# EAGLE schematic schema (EAGLE 9.4.2)
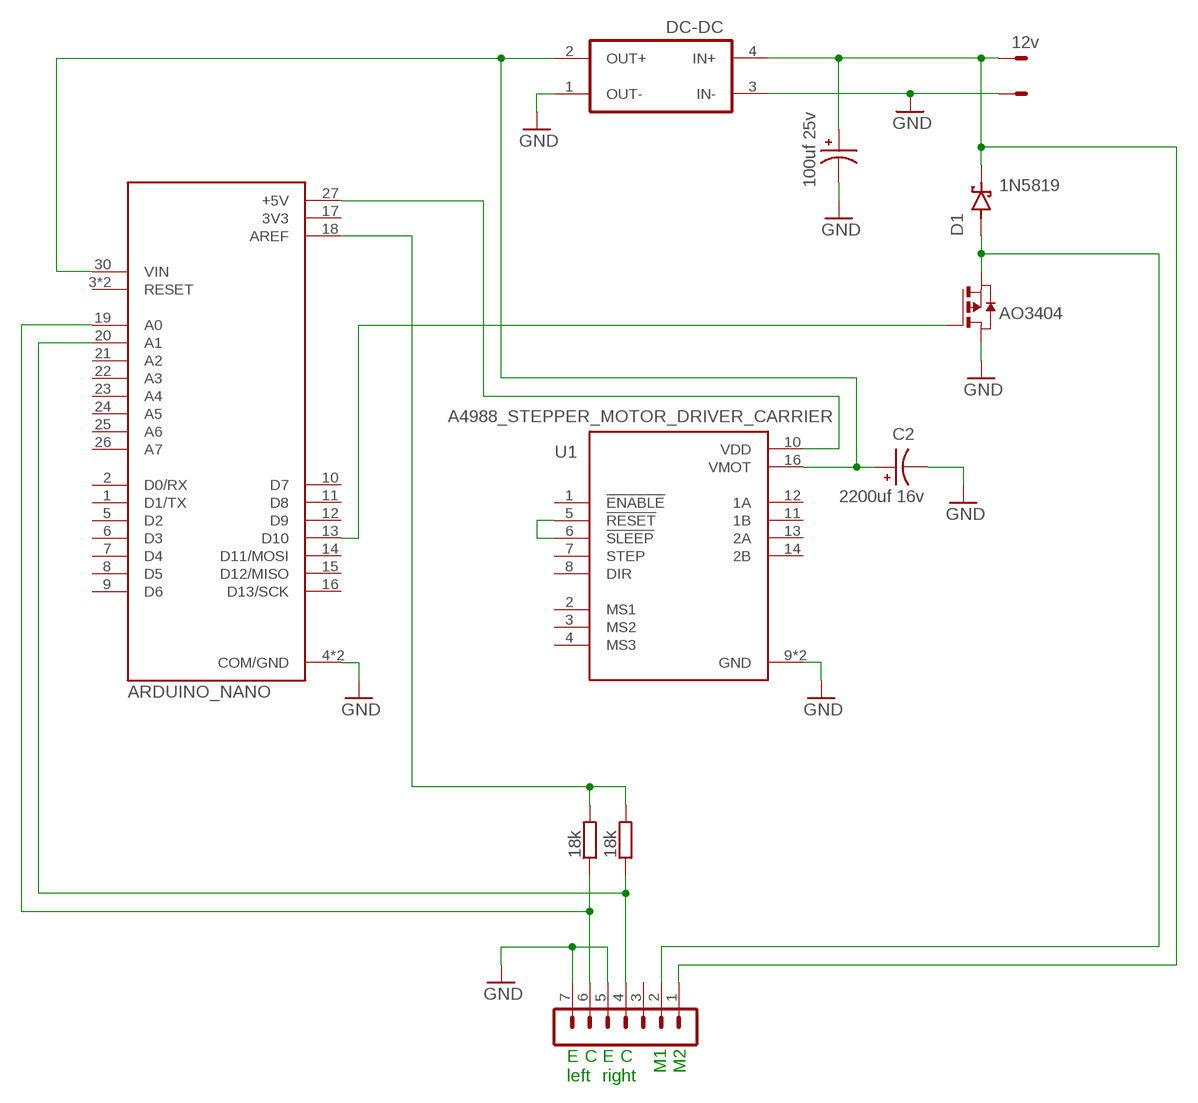
[diagram p0: schematic, sheet 1]

## Parts
C1  100uf 25v  EEUEB1E101H  [CAPPRD250W50D630H1500]
C2  2200uf 16v  EEUFM1C222  [CAPPRD500W60D1250H2500]
D1  1N5819  1N5819HW-7  [SOD3715X145N]
R1  18k  R  (no package)
R3  18k  R  (no package)
SV1  MA07-1  [MA07-1]
TB1  ARDUINO_NANO  [SHIELD_ARDUINO_NANO]
U1  A4988_STEPPER_MOTOR_DRIVER_CARRIER  [MODULE_A4988_STEPPER_MOTOR_DRIVER_CARRIER]
U$1  DC-DC_CONV  [DC-DC_CONV]
U$2  AO3404  AO3401  [SOT23]
X2  12v  22-23-2021  [22-23-2021]

## Nets
D10: TB1.13(D10) U$2.1(G)
GND: C1.N C2.N SV1.5 SV1.7 TB1.4(COM/GND) TB1.29(COM/GND) U1.9(GND) U1.15(GND) U$1.1(OUT-) U$1.3(IN-) U$2.3(D) X2.2
N$1: C1.P U$1.4(IN+) X2.1
N$2: D1.C(K) SV1.1
N$3: D1.A SV1.2 U$2.2(S)
N$4: R1.1 SV1.4 TB1.20(A1)
N$5: R3.1 SV1.6 TB1.19(A0)
N$6: R1.2 R3.2 TB1.18(AREF)
N$8: C2.P TB1.30(VIN) U1.16(VMOT) U$1.2(OUT+)
N$9: TB1.27(+5V) U1.10(VDD)
N$10: U1.5(!RESET) U1.6(!SLEEP)
Unconnected: SV1.3 TB1.1(D1/TX) TB1.2(D0/RX) TB1.3(RESET) TB1.5(D2) TB1.6(D3) TB1.7(D4) TB1.8(D5) TB1.9(D6) TB1.10(D7) TB1.11(D8) TB1.12(D9) TB1.14(D11/MOSI) TB1.15(D12/MISO) TB1.16(D13/SCK) TB1.21(A2) TB1.22(A3) TB1.23(A4) TB1.24(A5) TB1.25(A6) TB1.26(A7) TB1.28(RESET) U1.1(!ENABLE) U1.2(MS1) U1.3(MS2) U1.4(MS3) U1.7(STEP) U1.8(DIR) U1.11(1B) U1.12(1A) U1.13(2A) U1.14(2B)

## Notes on the sheet
- E | C | E | C
- M1 | M2
- left | right

## Power pins joined to a net without a drawn wire
3V3: TB1.17(3V3)

## Library data of the parts
C1 = EEUEB1E101H:EEUEB1E101H: EB-A Check availability <https://pricing.snapeda.com/parts/EEU-EB1E101H/Panasonic%20Electronic%20Components/view-part?ref=eda>; AVAILABILITY: In Stock; CHECK_PRICES: https://www.snapeda.com/parts/EEU-EB1E101H/Panasonic/view-part/?ref=eda; DESCRIPTION: CAP ALUM 100UF 20% 25V RADIAL; MF: Panasonic Electronic Components; MP: EEU-EB1E101H; PACKAGE: RADIAL-2 Panasonic; PRICE: None; SNAPEDA_LINK: https://www.snapeda.com/parts/EEU-EB1E101H/Panasonic/view-part/?ref=snap
C2 = EEUFM1C222:EEUFM1C222: FM-A Check availability <https://pricing.snapeda.com/parts/EEU-FM1C222/Panasonic/view-part?ref=eda>; AVAILABILITY: In Stock; CHECK_PRICES: https://www.snapeda.com/parts/EEU-FM1C222/Panasonic/view-part/?ref=eda; DESCRIPTION: Capacitor,Alum Lytic,Cap 2200 uF,Tol 20%,Vol-Rtg 16 VDC,Radial,12.5x25,Bulk | Panasonic Electronic Components EEU-FM1C222; MF: Panasonic; MP: EEU-FM1C222; PACKAGE: RADIAL-2 Panasonic; PRICE: None; PURCHASE-URL: https://www.snapeda.com/api/url_track_click_mouser/?unipart_id=2301865&manufacturer=Panasonic&part_name=EEU-FM1C222&search_term=2200uf 16v; SNAPEDA_LINK: https://www.snapeda.com/parts/EEU-FM1C222/Panasonic/view-part/?ref=snap
D1 = 1N5819HW-7:1N5819HW-7: 1N5819HW Series 40 V 1 A Surface Mount Schottky Barrier Rectifier - SOD-123 Check availability <https://pricing.snapeda.com/parts/1N5819HW-7/Diodes%20Inc./view-part?ref=eda>; AVAILABILITY: In Stock; CHECK_PRICES: https://www.snapeda.com/parts/1N5819HW-7/Diodes+Inc./view-part/?ref=eda; DESCRIPTION: Diode Schottky 40 V 1A Surface Mount SOD-123; MF: Diodes Inc.; MP: 1N5819HW-7; PACKAGE: SOD-123 Fairchild Semiconductor; PRICE: None; PURCHASE-URL: https://www.snapeda.com/api/url_track_click_mouser/?unipart_id=51510&manufacturer=Diodes Inc.&part_name=1N5819HW-7&search_term=1n5819; SNAPEDA_LINK: https://www.snapeda.com/parts/1N5819HW-7/Diodes+Inc./view-part/?ref=snap
R1 R3 = ngspice-simulation:R: RESISTOR
SV1 = con-lstb:MA07-1: PIN HEADER; OC_FARNELL: unknown; OC_NEWARK: unknown
TB1 = ARDUINO_NANO:ARDUINO_NANO: Arduino Nano, Through Hole Check availability <https://pricing.snapeda.com/parts/Arduino%20Nano/Arduino/view-part?ref=eda>; AVAILABILITY: Not in stock; CHECK_PRICES: https://www.snapeda.com/parts/Arduino%20Nano/Arduino/view-part/?ref=eda; DESCRIPTION: Small, complete, and breadboard-friendly board based on the ATmega328 (Arduino Nano 3.x); MF: Arduino; MP: Arduino Nano; PACKAGE: Non-Standard Arduino; PRICE: None; SNAPEDA_LINK: https://www.snapeda.com/parts/Arduino%20Nano/Arduino/view-part/?ref=snap
U1 = A4988_STEPPER_MOTOR_DRIVER_CARRIER:A4988_STEPPER_MOTOR_DRIVER_CARRIER: Stepper motor controler; IC: A4988; 1A; Uin mot: 8÷35V Check availability <https://pricing.snapeda.com/parts/A4988%20STEPPER%20MOTOR%20DRIVER%20CARRIER/Pololu/view-part?ref=eda>; AVAILABILITY: Not in stock; CHECK_PRICES: https://www.snapeda.com/parts/A4988%20STEPPER%20MOTOR%20DRIVER%20CARRIER/Pololu/view-part/?ref=eda; DESCRIPTION: Stepper Motor Driver; MF: Pololu; MP: A4988 STEPPER MOTOR DRIVER CARRIER; PACKAGE: None; PRICE: None; SNAPEDA_LINK: https://www.snapeda.com/parts/A4988%20STEPPER%20MOTOR%20DRIVER%20CARRIER/Pololu/view-part/?ref=snap
U$1 = devkrzyzanowskiLib:DC-DC_CONV
U$2 = AO3401:AO3401: Check availability <https://pricing.snapeda.com/parts/AO3401/Alpha%20%26%20Omega%20Semiconductor/view-part?ref=eda>; AVAILABILITY: In Stock; CHECK_PRICES: https://www.snapeda.com/parts/AO3401/Alpha+%2526+Omega+Semiconductor/view-part/?ref=eda; DESCRIPTION: P-Channel 30 V 4A (Ta) 1.4W (Ta) Surface Mount SOT-23-3; MF: Alpha & Omega Semiconductor; MP: AO3401; PACKAGE: SOT-23-3 Alpha &amp; Omega Semiconductor; PRICE: None; SNAPEDA_LINK: https://www.snapeda.com/parts/AO3401/Alpha+%2526+Omega+Semiconductor/view-part/?ref=snap
X2 = con-molex:22-23-2021: .100" (2.54mm) Center Header - 2 Pin